# EAGLE schematic Ges_AndriX (EAGLE 6.4)
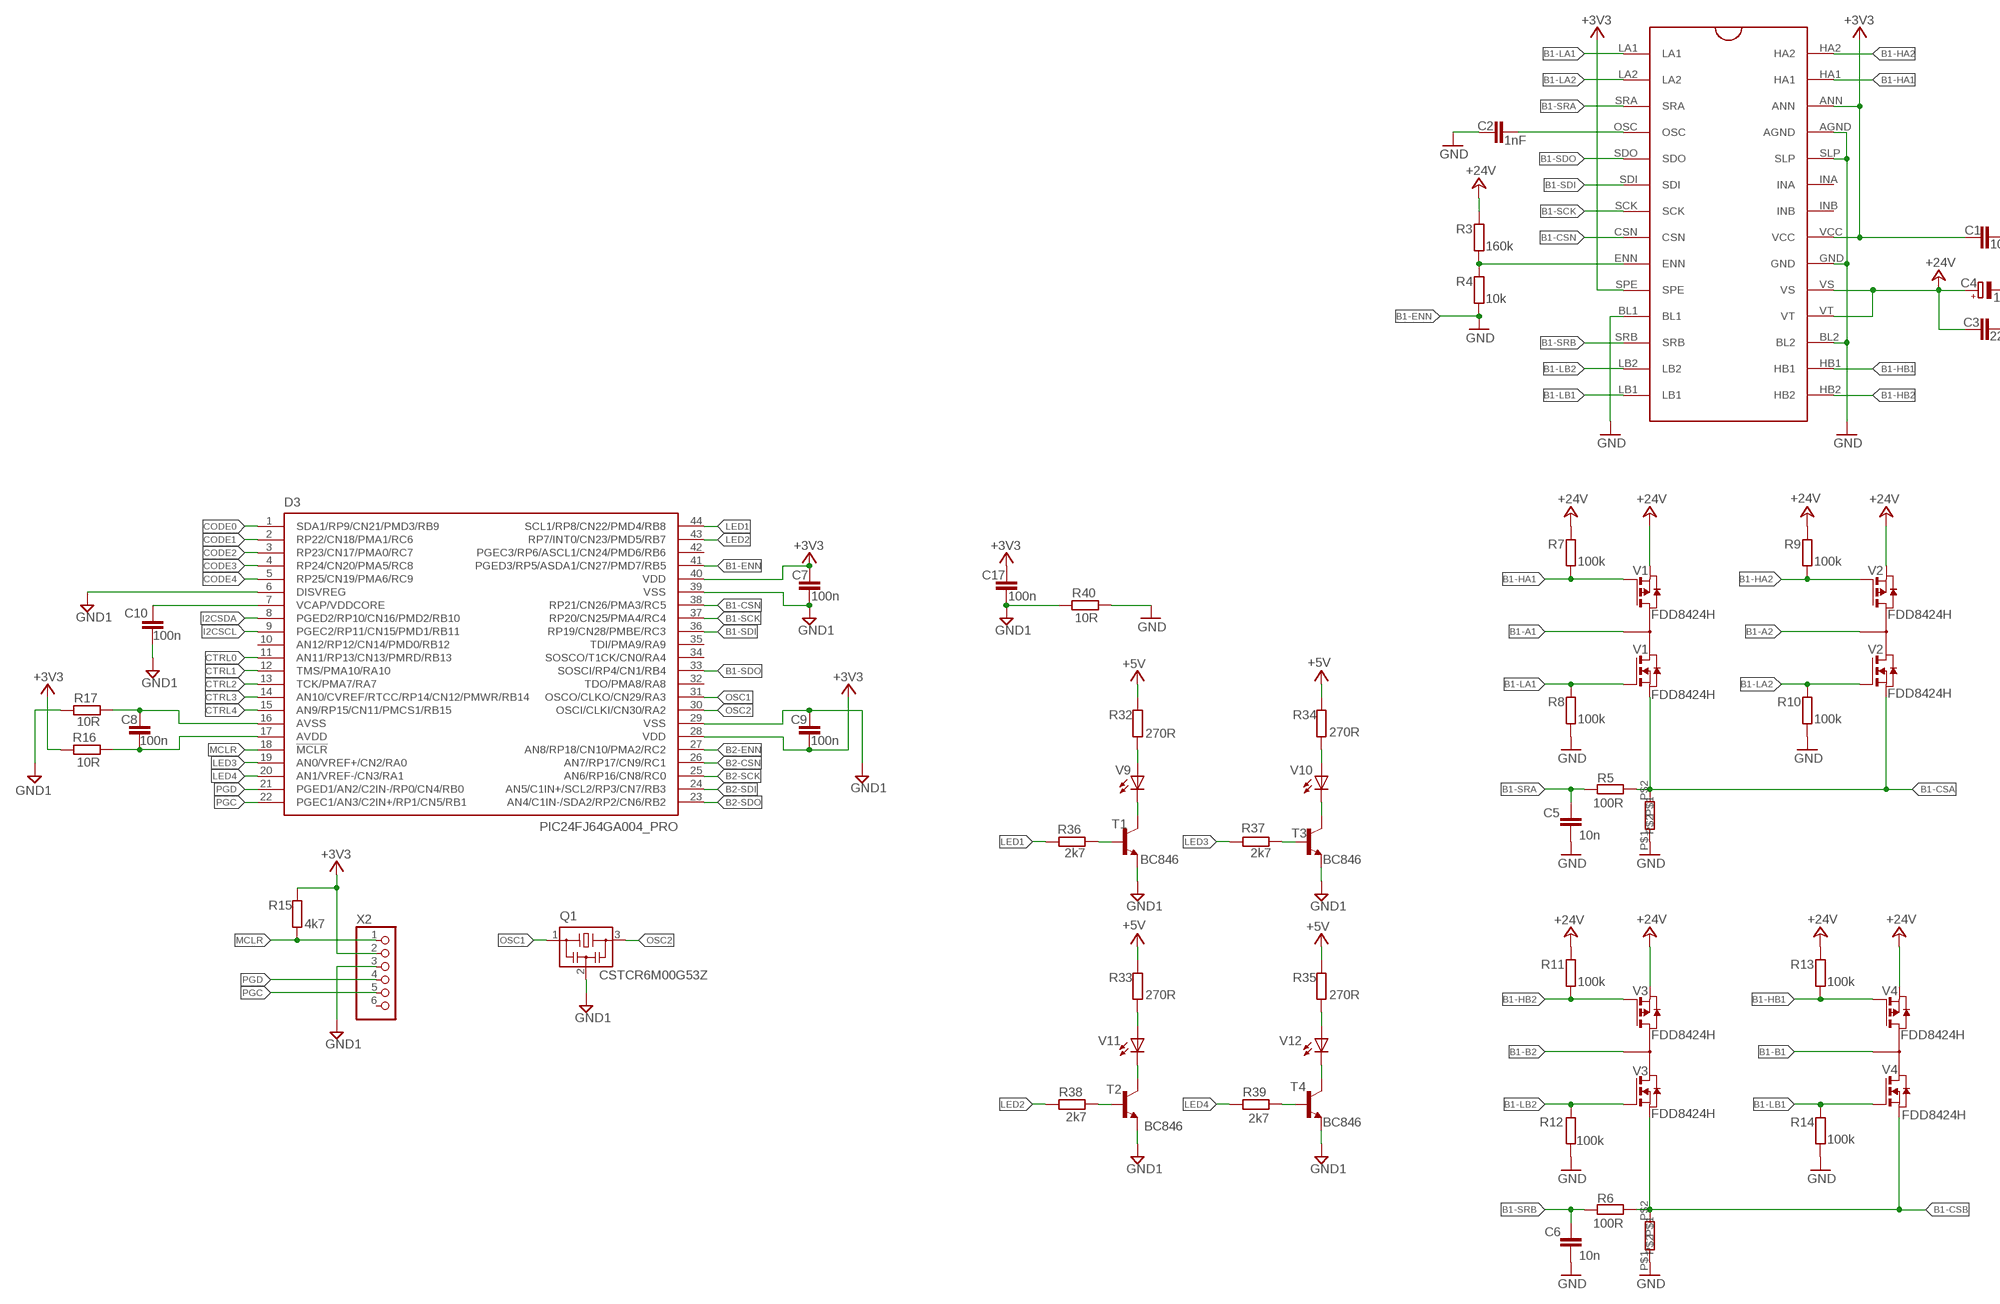
[diagram p0: schematic, sheet 1, part 1 of 2]
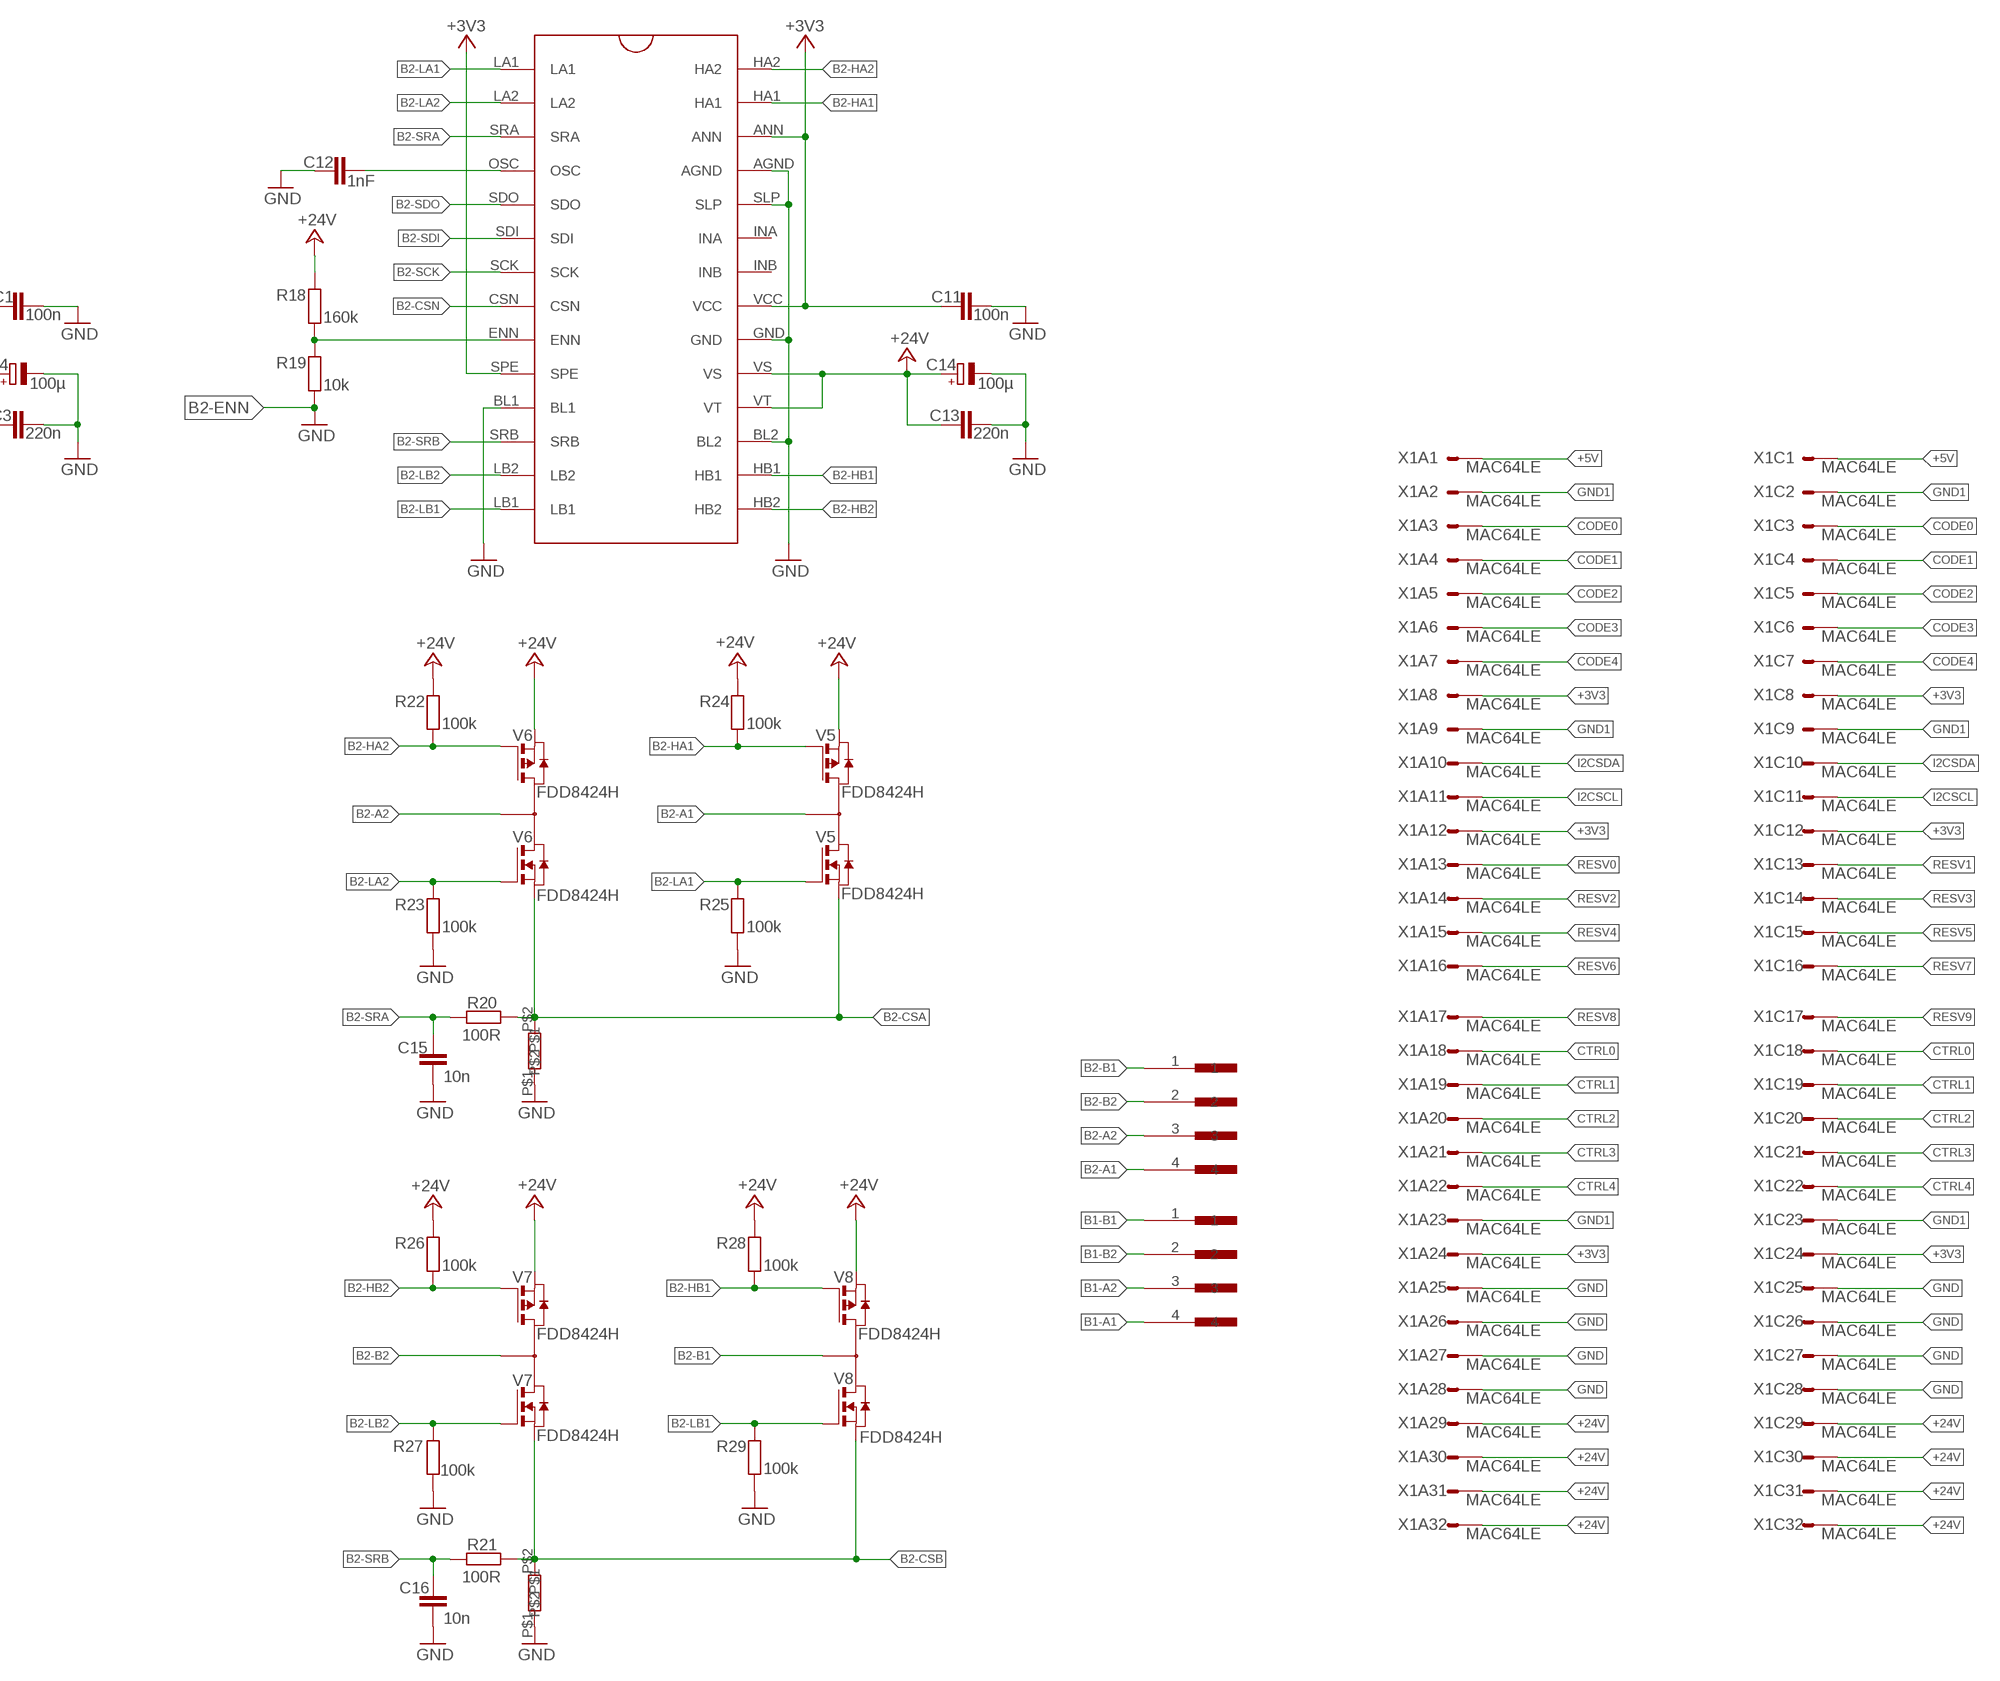
[diagram p1: schematic, sheet 1, part 2 of 2]

## Parts
C1  100n  C-EUC1206  [C1206]
C2  1nF  C-EUC1206  [C1206]
C3  220n  C-EUC1206  [C1206]
C4  100µ  CPOL-EU140CLH-1010  [140CLH-1010]
C5  10n  C-EUC1206  [C1206]
C6  10n  C-EUC1206  [C1206]
C7  100n  C-EUC1206K  [C1206K]
C8  100n  C-EUC1206K  [C1206K]
C9  100n  C-EUC1206K  [C1206K]
C10  100n  C-EUC1206K  [C1206K]
C11  100n  C-EUC1206  [C1206]
C12  1nF  C-EUC1206  [C1206]
C13  220n  C-EUC1206  [C1206]
C14  100µ  CPOL-EU140CLH-1010  [140CLH-1010]
C15  10n  C-EUC1206  [C1206]
C16  10n  C-EUC1206  [C1206]
C17  100n  C-EUC1206K  [C1206K]
D1  TMC249  [SO28]
D2  TMC249  [SO28]
D3  PIC24FJ64GA004_PRO  [TQFP44]
Q1  CSTCR6M00G53Z  [CSTER12M]
R1  30m  RS  [RS]
R2  30m  RS  [RS]
R3  160k  R-EU_M1206  [M1206]
R4  10k  R-EU_M1206  [M1206]
R5  100R  R-EU_M1206  [M1206]
R6  100R  R-EU_M1206  [M1206]
R7  100k  R-EU_R1206  [R1206]
R8  100k  R-EU_R1206  [R1206]
R9  100k  R-EU_R1206  [R1206]
R10  100k  R-EU_R1206  [R1206]
R11  100k  R-EU_R1206  [R1206]
R12  100k  R-EU_R1206  [R1206]
R13  100k  R-EU_R1206  [R1206]
R14  100k  R-EU_R1206  [R1206]
R15  4k7  R-EU_M1206  [M1206]
R16  10R  R-EU_M1206  [M1206]
R17  10R  R-EU_M1206  [M1206]
R18  160k  R-EU_M1206  [M1206]
R19  10k  R-EU_M1206  [M1206]
R20  100R  R-EU_M1206  [M1206]
R21  100R  R-EU_M1206  [M1206]
R22  100k  R-EU_R1206  [R1206]
R23  100k  R-EU_R1206  [R1206]
R24  100k  R-EU_R1206  [R1206]
R25  100k  R-EU_R1206  [R1206]
R26  100k  R-EU_R1206  [R1206]
R27  100k  R-EU_R1206  [R1206]
R28  100k  R-EU_R1206  [R1206]
R29  100k  R-EU_R1206  [R1206]
R30  30m  RS  [RS]
R31  30m  RS  [RS]
R32  270R  R-EU_M1206  [M1206]
R33  270R  R-EU_M1206  [M1206]
R34  270R  R-EU_M1206  [M1206]
R35  270R  R-EU_M1206  [M1206]
R36  2k7  R-EU_M1206  [M1206]
R37  2k7  R-EU_M1206  [M1206]
R38  2k7  R-EU_M1206  [M1206]
R39  2k7  R-EU_M1206  [M1206]
R40  10R  R-EU_M1206  [M1206]
T1  BC846  [SOT23]
T2  BC846  [SOT23]
T3  BC846  [SOT23]
T4  BC846  [SOT23]
V1  FDD8424H  [TO-252-4L]
V2  FDD8424H  [TO-252-4L]
V3  FDD8424H  [TO-252-4L]
V4  FDD8424H  [TO-252-4L]
V5  FDD8424H  [TO-252-4L]
V6  FDD8424H  [TO-252-4L]
V7  FDD8424H  [TO-252-4L]
V8  FDD8424H  [TO-252-4L]
V9  LEDCHIPLED_1206  [CHIPLED_1206]
V10  LEDCHIPLED_1206  [CHIPLED_1206]
V11  LEDCHIPLED_1206  [CHIPLED_1206]
V12  LEDCHIPLED_1206  [CHIPLED_1206]
X1  MAC64LE  [MAC64L]
X2  PINHD-1X6  [1X06]
X3  X_4POL  [X_4POL]
X4  X_4POL  [X_4POL]

## Nets
+3V3: C1.1 C7.2 C9.2 C11.1 C17.2 D1.ANN D1.SPE D1.VCC D2.ANN D2.SPE D2.VCC D3.28(VDD) D3.40(VDD) R15.2 R16.2 X1.A8 X1.A12 X1.A24 X1.C8 X1.C12 X1.C24 X2.2
+5V: R32.2 R33.2 R34.2 R35.2 X1.A1 X1.C1
+24V: C3.1 C4.+ C13.1 C14.+ D1.VS D1.VT D2.VS D2.VT R3.2 R7.2 R9.2 R11.2 R13.2 R18.2 R22.2 R24.2 R26.2 R28.2 V1.S2 V2.S2 V3.S2 V4.S2 V5.S2 V6.S2 V7.S2 V8.S2 X1.A29 X1.A30 X1.A31 X1.A32 X1.C29 X1.C30 X1.C31 X1.C32
B1-A1: V1.D1D2 X4.4
B1-A2: V2.D1D2 X4.3
B1-B1: V4.D1D2 X4.1
B1-B2: V3.D1D2 X4.2
B1-CSA: R2.P$2 R5.2 V1.S1 V2.S1
B1-CSB: R1.P$2 R6.2 V3.S1 V4.S1
B1-CSN: D2.CSN D3.38(RP21/CN26/PMA3/RC5)
B1-ENN: D3.41(PGED3/RP5/ASDA1/CN27/PMD7/RB5) R4.1 ; supply symbol labelled GND
B1-HA1: D2.HA1 R7.1 V1.G2
B1-HA2: D2.HA2 R9.1 V2.G2
B1-HB1: D2.HB1 R13.1 V4.G2
B1-HB2: D2.HB2 R11.1 V3.G2
B1-LA1: D2.LA1 R8.2 V1.G1
B1-LA2: D2.LA2 R10.2 V2.G1
B1-LB1: D2.LB1 R14.2 V4.G1
B1-LB2: D2.LB2 R12.2 V3.G1
B1-SCK: D2.SCK D3.37(RP20/CN25/PMA4/RC4)
B1-SDI: D2.SDI D3.36(RP19/CN28/PMBE/RC3)
B1-SDO: D2.SDO D3.33(SOSCI/RP4/CN1/RB4)
B1-SRA: C5.1 D2.SRA R5.1
B1-SRB: C6.1 D2.SRB R6.1
B2-A1: V5.D1D2 X3.4
B2-A2: V6.D1D2 X3.3
B2-B1: V8.D1D2 X3.1
B2-B2: V7.D1D2 X3.2
B2-CSA: R20.2 R30.P$2 V5.S1 V6.S1
B2-CSB: R21.2 R31.P$2 V7.S1 V8.S1
B2-CSN: D1.CSN D3.26(AN7/RP17/CN9/RC1)
B2-ENN: D3.27(AN8/RP18/CN10/PMA2/RC2) R19.1 ; supply symbol labelled GND
B2-HA1: D1.HA1 R24.1 V5.G2
B2-HA2: D1.HA2 R22.1 V6.G2
B2-HB1: D1.HB1 R28.1 V8.G2
B2-HB2: D1.HB2 R26.1 V7.G2
B2-LA1: D1.LA1 R25.2 V5.G1
B2-LA2: D1.LA2 R23.2 V6.G1
B2-LB1: D1.LB1 R29.2 V8.G1
B2-LB2: D1.LB2 R27.2 V7.G1
B2-SCK: D1.SCK D3.25(AN6/RP16/CN8/RC0)
B2-SDI: D1.SDI D3.24(AN5/C1IN+/SCL2/RP3/CN7/RB3)
B2-SDO: D1.SDO D3.23(AN4/C1IN-/SDA2/RP2/CN6/RB2)
B2-SRA: C15.1 D1.SRA R20.1
B2-SRB: C16.1 D1.SRB R21.1
CODE0: D3.1(SDA1/RP9/CN21/PMD3/RB9) X1.A3 X1.C3
CODE1: D3.2(RP22/CN18/PMA1/RC6) X1.A4 X1.C4
CODE2: D3.3(RP23/CN17/PMA0/RC7) X1.A5 X1.C5
CODE3: D3.4(RP24/CN20/PMA5/RC8) X1.A6 X1.C6
CODE4: D3.5(RP25/CN19/PMA6/RC9) X1.A7 X1.C7
CTRL0: D3.11(AN11/RP13/CN13/PMRD/RB13) X1.A18 X1.C18
CTRL1: D3.12(TMS/PMA10/RA10) X1.A19 X1.C19
CTRL2: D3.13(TCK/PMA7/RA7) X1.A20 X1.C20
CTRL3: D3.14(AN10/CVREF/RTCC/RP14/CN12/PMWR/RB14) X1.A21 X1.C21
CTRL4: D3.15(AN9/RP15/CN11/PMCS1/RB15) X1.A22 X1.C22
GND: C1.2 C2.2 C3.2 C4.- C5.2 C6.2 C11.2 C12.2 C13.2 C14.- C15.2 C16.2 D1.AGND D1.BL1 D1.BL2 D1.GND D1.SLP D2.AGND D2.BL1 D2.BL2 D2.GND D2.SLP R1.P$1 R2.P$1 R8.1 R10.1 R12.1 R14.1 R23.1 R25.1 R27.1 R29.1 R30.P$1 R31.P$1 R40.1 X1.A25 X1.A26 X1.A27 X1.A28 X1.C25 X1.C26 X1.C27 X1.C28
GND1: C7.1 C9.1 C10.2 C17.1 D3.6(DISVREG) D3.29(VSS) D3.39(VSS) Q1.2 R17.2 R40.2 T1.2(E) T2.2(E) T3.2(E) T4.2(E) X1.A2 X1.A9 X1.A23 X1.C2 X1.C9 X1.C23 X2.3
I2CSCL: D3.9(PGEC2/RP11/CN15/PMD1/RB11) X1.A11 X1.C11
I2CSDA: D3.8(PGED2/RP10/CN16/PMD2/RB10) X1.A10 X1.C10
LED1: D3.44(SCL1/RP8/CN22/PMD4/RB8) R36.2
LED2: D3.43(RP7/INT0/CN23/PMD5/RB7) R38.1
LED3: D3.19(AN0/VREF+/CN2/RA0) R37.2
LED4: D3.20(AN1/VREF-/CN3/RA1) R39.2
MCLR: D3.18(!MCLR) R15.1 X2.1
N$1: C2.1 D2.OSC
N$3: C8.2 D3.17(AVDD) R16.1
N$4: C8.1 D3.16(AVSS) R17.1
N$5: C10.1 D3.7(VCAP/VDDCORE)
N$6: T1.3(C) V9.C
N$8: C12.1 D1.OSC
N$9: T2.3(C) V11.C
N$10: T3.3(C) V10.C
N$11: D1.ENN R18.1 R19.2
N$12: T4.3(C) V12.C
N$13: R32.1 V9.A
N$14: R33.1 V11.A
N$15: R34.1 V10.A
N$16: R35.1 V12.A
N$17: R36.1 T1.1(B)
N$18: D2.ENN R3.1 R4.2
N$19: R37.1 T3.1(B)
N$20: R38.2 T2.1(B)
N$21: R39.1 T4.1(B)
OSC1: D3.31(OSCO/CLKO/CN29/RA3) Q1.1
OSC2: D3.30(OSCI/CLKI/CN30/RA2) Q1.3
PGC: D3.22(PGEC1/AN3/C2IN+/RP1/CN5/RB1) X2.5
PGD: D3.21(PGED1/AN2/C2IN-/RP0/CN4/RB0) X2.4
RESV0: X1.A13
RESV1: X1.C13
RESV2: X1.A14
RESV3: X1.C14
RESV4: X1.A15
RESV5: X1.C15
RESV6: X1.A16
RESV7: X1.C16
RESV8: X1.A17
RESV9: X1.C17
Unconnected: D1.INA D1.INB D2.INA D2.INB D3.10(AN12/RP12/CN14/PMD0/RB12) D3.32(TDO/PMA8/RA8) D3.34(SOSCO/T1CK/CN0/RA4) D3.35(TDI/PMA9/RA9) D3.42(PGEC3/RP6/ASCL1/CN24/PMD6/RB6) X2.6

## Library data of the parts
C1-C3 C5 C6 C11-C13 C15 C16 = resistor:C-EU: CAPACITOR, European symbol
C4 C14 = resistor:CPOL-EU: POLARIZED CAPACITOR, European symbol
C7-C10 C17 = rcl:C-EU: CAPACITOR, European symbol
D1 D2 = Projekt:TMC249
D3 = microchip:PIC24FJ64GA004_PRO
Q1 = cstce-resonator:CSTCR: Resonator Source: murata.co.jp; MPN: CSTCC12M0; OC_FARNELL: 1170434; OC_NEWARK: 25M8759
R1 R2 R30 R31 = Projekt:RS
R3-R6 R15-R21 R32-R40 = rcl:R-EU_: RESISTOR, European symbol
R7-R14 R22-R29 = resistor:R-EU_: RESISTOR, European symbol
T1-T4 = transistor:BC846: NPN TRANSISTOR
V1-V8 = Projekt:FDD8424H; V: FDD8424H
V9-V12 = led:LED: LED OSRAM: - CHIPLED LG R971, LG N971, LY N971, LG Q971, LY Q971, LO R971, LY R971 LH N974, LH R974 LS Q976, LO Q976, LY Q976 LO Q996 - Hyper CHIPLED LW Q18S LB Q993, LB Q99A, LB R99A - SideLED LS A670, LO A670, LY A670, LG A670, LP A670 LB A673, LV A673, LT A673, LW A673 LH A674 LY A675 LS A676, LA A676, LO A676, LY A676, LW A676 LS A679, LY A679, LG A679 - Hyper Micro SIDELED® LS Y876, LA Y876, LO Y876, LY Y876 LT Y87S - SmartLED LW L88C, LW L88S LB L89C, LB L89S, LG L890 LS L89K, LO L89K, LY L89K LS L896, LA L896, LO L896, LY L896 - TOPLED LS T670, LO T670, LY T670, LG T670, LP T670 LSG T670, LSP T670, LSY T670, LOP T670, LYG T670 LG T671, LOG T671, LSG T671 LB T673, LV T673, LT T673, LW T673 LH T674 LS T676, LA T676, LO T676, LY T676, LB T676, LH T676, LSB T676, LW T676 LB T67C, LV T67C, LT T67C, LS T67K, LO T67K, LY T67K, LW E67C LS E67B, LA E67B, LO E67B, LY E67B, LB E67C, LV E67C, LT E67C LW T67C LS T679, LY T679, LG T679 LS T770, LO T770, LY T770, LG T770, LP T770 LB T773, LV T773, LT T773, LW T773 LH T774 LS E675, LA E675, LY E675, LS T675 LS T776, LA T776, LO T776, LY T776, LB T776 LHGB T686 LT T68C, LB T68C - Hyper Mini TOPLED® LB M676 - Mini TOPLED Santana® LG M470 LS M47K, LO M47K, LY M47K Source: http://www.osram.convergy.de LUXEON: - LUMILED® LXK2-PW12-R00, LXK2-PW12-S00, LXK2-PW14-U00, LXK2-PW14-V00 LXK2-PM12-R00, LXK2-PM12-S00, LXK2-PM14-U00 LXK2-PE12-Q00, LXK2-PE12-R00, LXK2-PE12-S00, LXK2-PE14-T00, LXK2-PE14-U00 LXK2-PB12-K00, LXK2-PB12-L00, LXK2-PB12-M00, LXK2-PB14-N00, LXK2-PB14-P00, LXK2-PB14-Q00 LXK2-PR12-L00, LXK2-PR12-M00, LXK2-PR14-Q00, LXK2-PR14-R00 LXK2-PD12-Q00, LXK2-PD12-R00, LXK2-PD12-S00 LXK2-PH12-R00, LXK2-PH12-S00 LXK2-PL12-P00, LXK2-PL12-Q00, LXK2-PL12-R00 Source: www.luxeon.com KINGBRIGHT: KA-3528ASYC Source: www.kingbright.com
X1 = con-vg:MAC64LE: CONNECTOR male, 64 pins, single, type C, rows AC, grid 5.08 mm
X2 = pinhead:PINHD-1X6: PIN HEADER
X3 X4 = Projekt:X_4POL